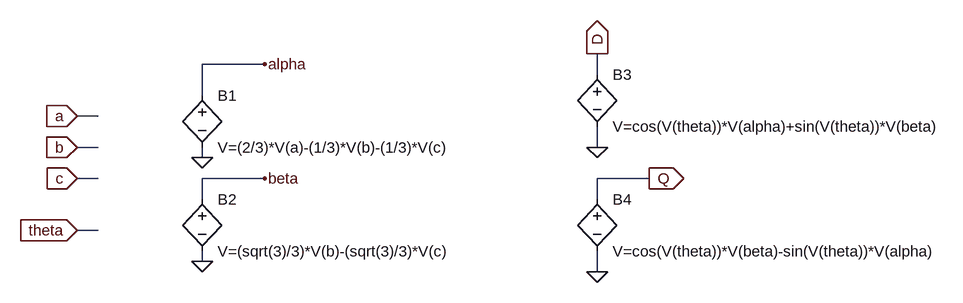
[diagram p0: schematic abctodq.asc]
abctodq.asc, the LTspice schematic file:
Version 4
SHEET 1 1548 680
WIRE 432 16 336 16
WIRE 944 32 944 0
WIRE 336 64 336 16
WIRE 176 96 144 96
WIRE 176 144 144 144
WIRE 944 144 944 112
WIRE 336 160 336 144
WIRE 176 192 144 192
WIRE 432 192 336 192
WIRE 1024 192 944 192
WIRE 336 224 336 192
WIRE 944 224 944 192
WIRE 176 272 144 272
WIRE 336 320 336 304
WIRE 944 336 944 304
FLAG 144 96 a
IOPIN 144 96 In
FLAG 144 144 b
IOPIN 144 144 In
FLAG 144 192 c
IOPIN 144 192 In
FLAG 336 160 0
FLAG 336 320 0
FLAG 432 16 alpha
FLAG 432 192 beta
FLAG 944 336 0
FLAG 944 144 0
FLAG 944 0 D
IOPIN 944 0 Out
FLAG 1024 192 Q
IOPIN 1024 192 Out
FLAG 144 272 theta
IOPIN 144 272 In
SYMBOL bv 336 48 R0
SYMATTR InstName B1
SYMATTR Value V=(2/3)*V(a)-(1/3)*V(b)-(1/3)*V(c)
SYMBOL bv 336 208 R0
SYMATTR InstName B2
SYMATTR Value V=(sqrt(3)/3)*V(b)-(sqrt(3)/3)*V(c)
SYMBOL bv 944 16 R0
SYMATTR InstName B3
SYMATTR Value V=cos(V(theta))*V(alpha)+sin(V(theta))*V(beta)
SYMBOL bv 944 208 R0
SYMATTR InstName B4
SYMATTR Value V=cos(V(theta))*V(beta)-sin(V(theta))*V(alpha)

The netlist it stands for:
* abctodq.asc
B1 alpha 0 V=(2/3)*V(a)-(1/3)*V(b)-(1/3)*V(c)
B2 beta 0 V=(sqrt(3)/3)*V(b)-(sqrt(3)/3)*V(c)
B3 D 0 V=cos(V(theta))*V(alpha)+sin(V(theta))*V(beta)
B4 Q 0 V=cos(V(theta))*V(beta)-sin(V(theta))*V(alpha)
.backanno
.end